# EAGLE design auto_shield_final (EAGLE 9.2.2)
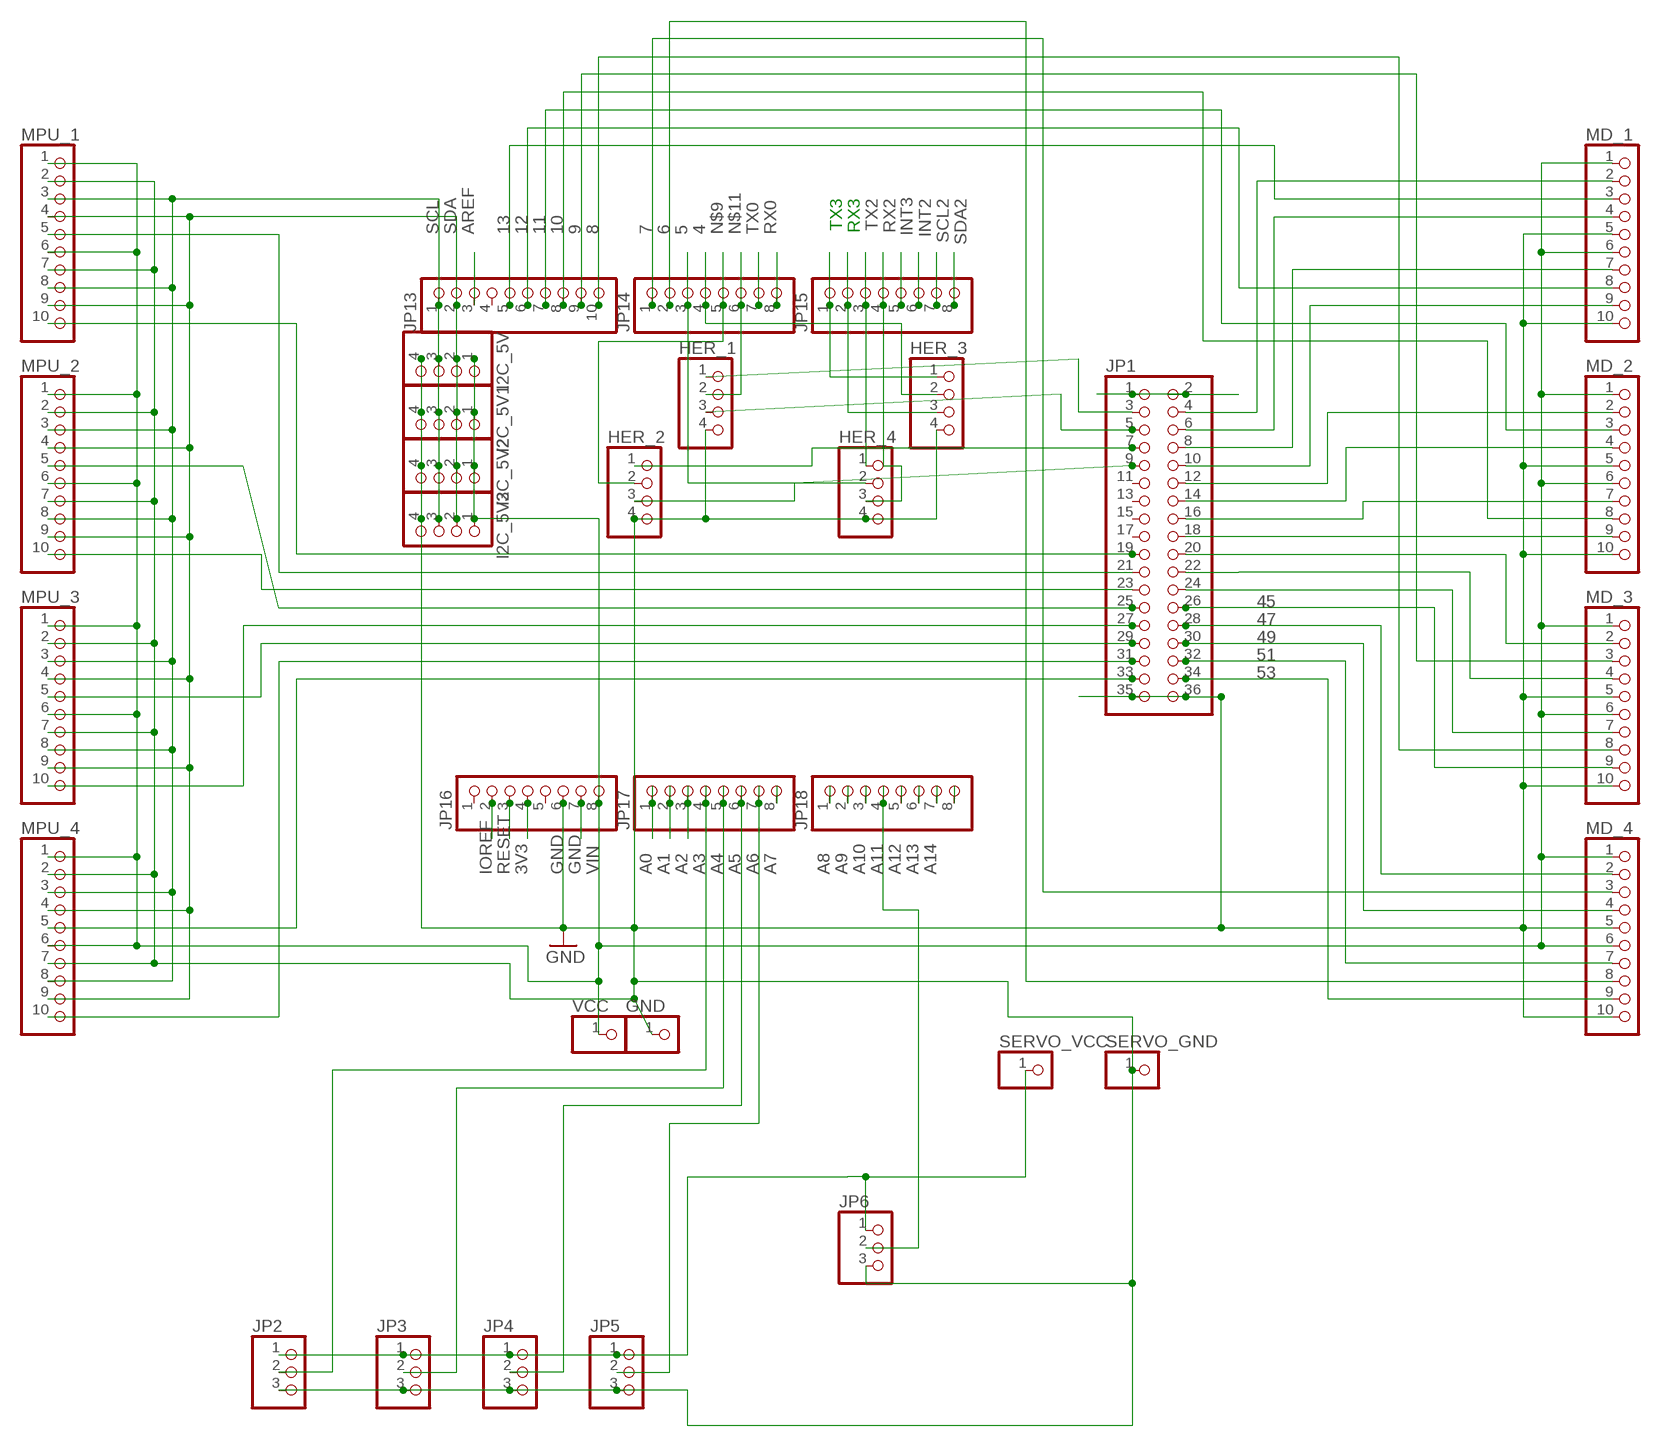
[diagram p0: schematic, sheet 1]

## Parts
GND  PINHD-1X1  [1X01]
HER_1  PINHD-1X4  [1X04]
HER_2  PINHD-1X4  [1X04]
HER_3  PINHD-1X4  [1X04]
HER_4  PINHD-1X4  [1X04]
I2C_5V  PINHD-1X4  [1X04]
I2C_5V1  PINHD-1X4  [1X04]
I2C_5V2  PINHD-1X4  [1X04]
I2C_5V3  PINHD-1X4  [1X04]
JP1  PINHD-2X18  [2X18]
JP2  PINHD-1X3  [1X03]
JP3  PINHD-1X3  [1X03]
JP4  PINHD-1X3  [1X03]
JP5  PINHD-1X3  [1X03]
JP6  PINHD-1X3  [1X03]
JP13  PINHD-1X10  [1X10]
JP14  PINHD-1X8  [1X08]
JP15  PINHD-1X8  [1X08]
JP16  PINHD-1X8  [1X08]
JP17  PINHD-1X8  [1X08]
JP18  PINHD-1X8  [1X08]
MD_1  PINHD-1X10  [1X10]
MD_2  PINHD-1X10  [1X10]
MD_3  PINHD-1X10  [1X10]
MD_4  PINHD-1X10  [1X10]
MPU_1  PINHD-1X10  [1X10]
MPU_2  PINHD-1X10  [1X10]
MPU_3  PINHD-1X10  [1X10]
MPU_4  PINHD-1X10  [1X10]
SERVO_GND  PINHD-1X1  [1X01]
SERVO_VCC  PINHD-1X1  [1X01]
VCC  PINHD-1X1  [1X01]

## Nets
3V3: JP16.4
4: HER_3.2 JP14.4
5: HER_4.2 JP14.3
6: JP14.2 MD_4.8
7: JP14.1 MD_4.3
8: JP13.10 MD_3.8
9: JP13.9 MD_3.3
10: JP13.8 MD_2.8
11: JP13.7 MD_2.3
12: JP13.6 MD_1.8
13: JP13.5 MD_1.3
24: HER_1.3 JP1.5
26: HER_2.1 JP1.7
28: HER_2.3 JP1.9
38: JP1.19 MPU_1.10
44: JP1.25 MPU_2.5
45: JP1.26 MD_3.9
46: JP1.27 MPU_3.10
47: JP1.28 MD_4.2
48: JP1.29 MPU_3.5
49: JP1.30 MD_4.4
50: JP1.31 MPU_4.10
51: JP1.32 MD_4.7
52: JP1.33 MPU_4.5
53: JP1.34 MD_4.9
A0: JP17.1
A1: JP17.2
A2: JP17.3
A3: JP2.2 JP17.4
A4: JP3.2 JP17.5
A5: JP4.2 JP17.6
A6: JP5.2 JP17.7
A7: JP17.8
A8: JP18.1
A9: JP18.2
A10: JP18.3
A11: JP6.2 JP18.4
A12: JP18.5
A13: JP18.6
A14: JP18.7
AREF: JP13.3
GND: GND.1 HER_1.4 HER_2.4 HER_3.4 HER_4.4 I2C_5V1.4 I2C_5V2.4 I2C_5V3.4 I2C_5V.4 JP1.35 JP1.36 JP2.3 JP3.3 JP4.3 JP5.3 JP6.3 JP16.6 JP16.7 MD_1.5 MD_1.10 MD_2.5 MD_2.10 MD_3.5 MD_3.10 MD_4.5 MD_4.10 MPU_1.2 MPU_1.7 MPU_2.2 MPU_2.7 MPU_3.2 MPU_3.7 MPU_4.2 MPU_4.7 SERVO_GND.1
INT2: JP15.6
INT3: JP15.5
IOREF: JP16.2
N$1: HER_1.1 JP1.3
N$2: JP1.1 JP1.2
N$3: JP18.8
N$4: JP1.4 MD_1.2
N$5: JP2.1 JP3.1 JP4.1 JP5.1 JP6.1 SERVO_VCC.1
N$6: JP1.6 MD_1.4
N$7: JP1.8 MD_1.7
N$8: JP1.10 MD_1.9
N$9: HER_2.2 JP14.5
N$11: HER_1.2 JP14.6
N$12: JP1.14 MD_2.4
N$13: JP1.12 MD_2.2
N$14: JP1.16 MD_2.7
N$15: JP1.18 MD_2.9
N$16: JP1.20 MD_3.2
N$17: JP1.22 MD_3.4
N$18: JP1.24 MD_3.7
N$20: JP1.21 MPU_1.5
N$25: JP1.23 MPU_2.10
RESET: JP16.3
RX0: JP14.8
RX2: HER_4.3 JP15.4
RX3: HER_3.3 JP15.2
SCL: I2C_5V1.3 I2C_5V2.3 I2C_5V3.3 I2C_5V.3 JP13.1 MPU_1.3 MPU_1.8 MPU_2.3 MPU_2.8 MPU_3.3 MPU_3.8 MPU_4.3 MPU_4.8
SCL2: JP15.7
SDA: I2C_5V1.2 I2C_5V2.2 I2C_5V3.2 I2C_5V.2 JP13.2 MPU_1.4 MPU_1.9 MPU_2.4 MPU_2.9 MPU_3.4 MPU_3.9 MPU_4.4 MPU_4.9
SDA2: JP15.8
TX0: JP14.7
TX2: HER_4.1 JP15.3
TX3: HER_3.1 JP15.1
VIN: I2C_5V1.1 I2C_5V2.1 I2C_5V3.1 I2C_5V.1 JP16.8 MD_1.1 MD_1.6 MD_2.1 MD_2.6 MD_3.1 MD_3.6 MD_4.1 MD_4.6 MPU_1.1 MPU_1.6 MPU_2.1 MPU_2.6 MPU_3.1 MPU_3.6 MPU_4.1 MPU_4.6 VCC.1
Unconnected: JP1.11 JP1.13 JP1.15 JP1.17 JP13.4 JP16.1 JP16.5

## Library data of the parts
GND SERVO_GND SERVO_VCC VCC = pinhead:PINHD-1X1: PIN HEADER
HER_1-HER_4 I2C_5V I2C_5V1-I2C_5V3 = pinhead:PINHD-1X4: PIN HEADER
JP1 = pinhead:PINHD-2X18: PIN HEADER
JP2-JP6 = pinhead:PINHD-1X3: PIN HEADER
JP13 MD_1-MD_4 MPU_1-MPU_4 = pinhead:PINHD-1X10: PIN HEADER
JP14-JP18 = pinhead:PINHD-1X8: PIN HEADER

## Net classes
1 vcc: width 0.305 mm

## Board
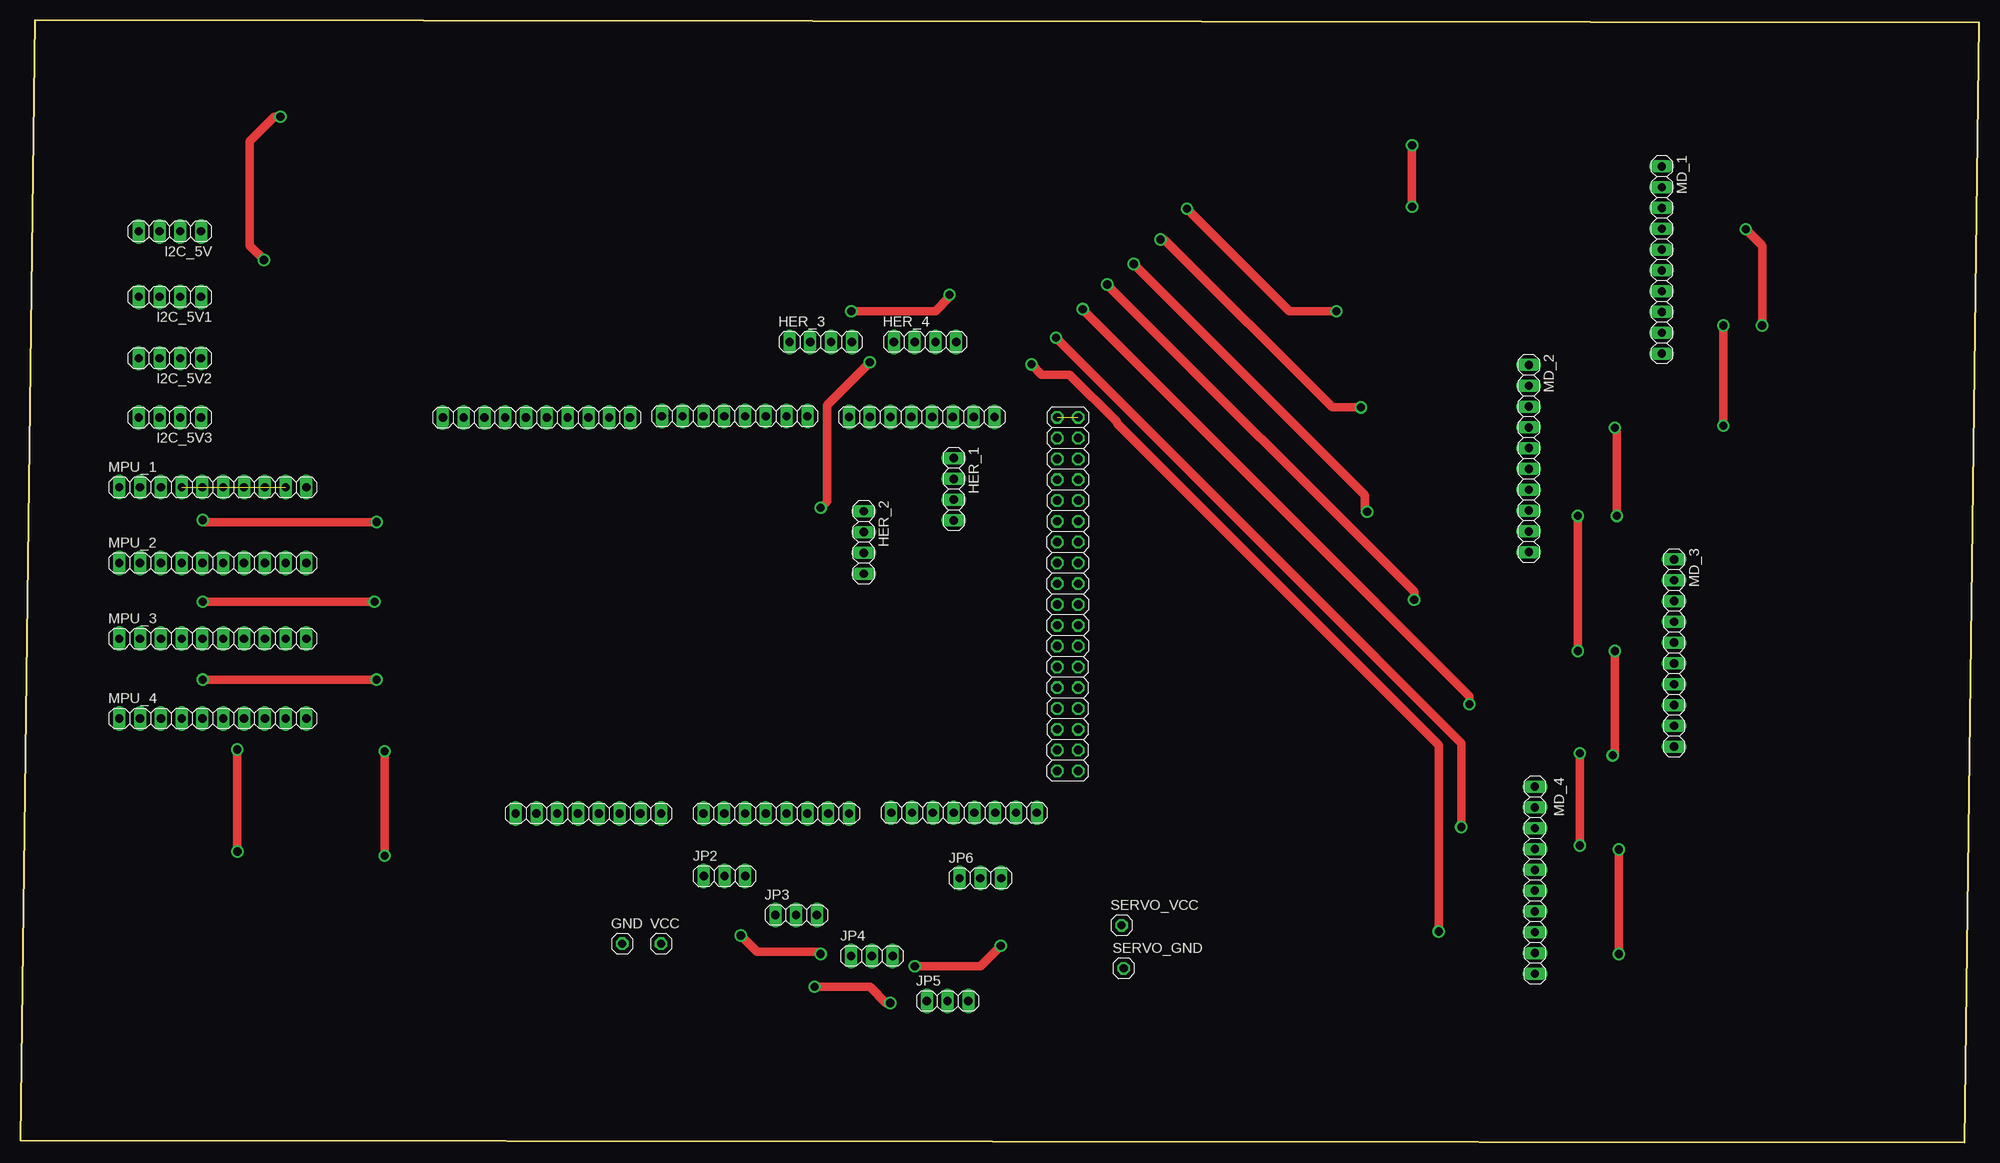
[diagram p1: board, top side]
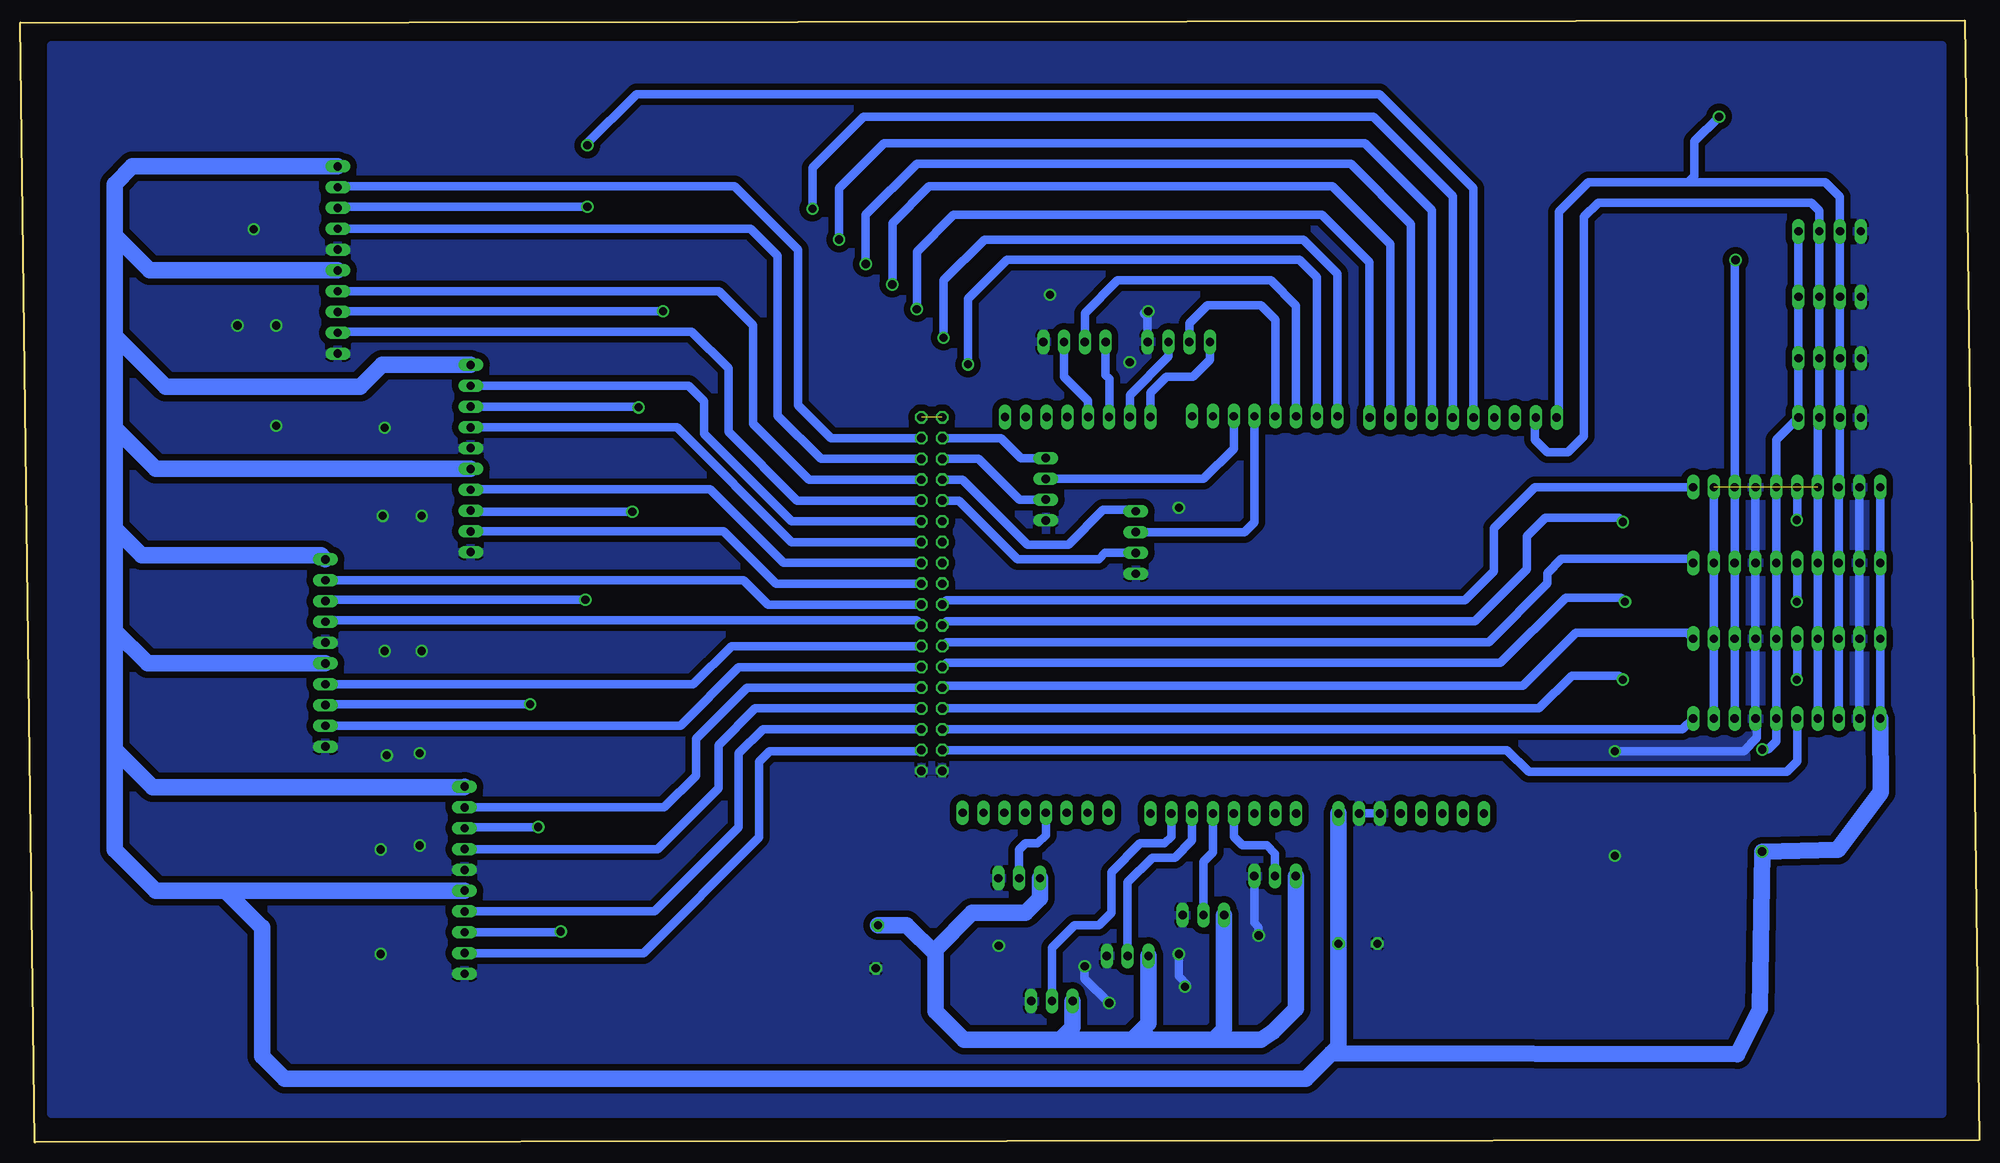
[diagram p2: board, bottom side, seen from below]

Size 239.25 x 137 mm. Coordinates in mm from the lower left corner, seen from the top.
Outline: 0,0.25 237.5,0 239.25,136.75 1.75,137 0,0.25
Copper layers (1*16): Top 0.035mm / dielectric 1.5mm / Bottom 0.035mm
Design rules "default": minimum track width 10mil, minimum drill 24mil, track to track 8mil, track to pad 8mil, pad to pad 8mil, via to via 8mil, smd to smd 8mil, copper to edge 40mil, drill to drill 8mil, minimum pad ring 10mil, minimum via ring 8mil, stop-mask expansion 4mil, vias tented up to drill 0mil, thermal gap 10mil

### Footprints (pad centres in the part's own frame; a part is rotated, then mirrored left to right if it is on the bottom)
1X01 = drill 1.016 octagon: 1 0,0
1X04 = drill 1.016 long: 1 -3.81,0; 2 -1.27,0; 3 1.27,0; 4 3.81,0
2X18 = drill 1.016 octagon: 1 -21.59,-1.27; 2 -21.59,1.27; 3 -19.05,-1.27; 4 -19.05,1.27; 5 -16.51,-1.27; 6 -16.51,1.27; 7 -13.97,-1.27; 8 -13.97,1.27; 9 -11.43,-1.27; 10 -11.43,1.27; 11 -8.89,-1.27; 12 -8.89,1.27; 13 -6.35,-1.27; 14 -6.35,1.27; 15 -3.81,-1.27; 16 -3.81,1.27; 17 -1.27,-1.27; 18 -1.27,1.27; 19 1.27,-1.27; 20 1.27,1.27; 21 3.81,-1.27; 22 3.81,1.27; 23 6.35,-1.27; 24 6.35,1.27; 25 8.89,-1.27; 26 8.89,1.27; 27 11.43,-1.27; 28 11.43,1.27; 29 13.97,-1.27; 30 13.97,1.27; 31 16.51,-1.27; 32 16.51,1.27; 33 19.05,-1.27; 34 19.05,1.27; 35 21.59,-1.27; 36 21.59,1.27
1X03 = drill 1.016 long: 1 -2.54,0; 2 0,0; 3 2.54,0
1X10 = drill 1.016 long: 1 -11.43,0; 2 -8.89,0; 3 -6.35,0; 4 -3.81,0; 5 -1.27,0; 6 1.27,0; 7 3.81,0; 8 6.35,0; 9 8.89,0; 10 11.43,0
1X08 = drill 1.016 long: 1 -8.89,0; 2 -6.35,0; 3 -3.81,0; 4 -1.27,0; 5 1.27,0; 6 3.81,0; 7 6.35,0; 8 8.89,0

### Placement (x,y rotation side)
GND  73.5,24.25 0 top
HER_1  114,79.75 270 top
HER_2  103,73.25 270 top
HER_3  97.75,97.75 0 top
HER_4  110.5,97.75 0 top
I2C_5V  18.25,111.25 180 top
I2C_5V1  18.25,103.25 180 top
I2C_5V2  18.25,95.75 180 top
I2C_5V3  18.25,88.5 180 top
JP1  127.92,66.94 270 top
JP2  86,32.5 0 top
JP3  94.75,27.75 0 top
JP4  104,22.75 0 top
JP5  113.25,17.25 0 top
JP6  117.25,32.25 0 top
JP13  63.02,88.5 0 top
JP14  87.24,88.67 0 top
JP15  110.09,88.58 0 top
JP16  69.37,40.16 0 top
JP17  92.32,40.16 0 top
JP18  115.26,40.24 0 top
MD_1  200.5,107.75 270 top
MD_2  184.25,83.5 270 top
MD_3  202,59.75 270 top
MD_4  185,32 270 top
MPU_1  23.5,80 0 top
MPU_2  23.5,70.75 0 top
MPU_3  23.5,61.5 0 top
MPU_4  23.5,51.75 0 top
SERVO_GND  134.75,21.25 0 top
SERVO_VCC  134.5,26.5 0 top
VCC  78.25,24.25 0 top

### Tracks (layer width: path | path; a pad name or v marks a point on that pad's centre or on a via)
4
  Bottom 1.016: HER_3.2 96.48,100.02 94.25,102.25 87.75,102.25 85.97,100.47 JP14.4
5
  Bottom 1.016: 83.36,88.6 JP14.3 83.43,102.18 86.5,105.25 105.25,105.25 109.23,101.27 HER_4.2
6  (via drill 1 pad 1.3)
  Top 1.016: v173.25,25.75 173.25,48.5 133.92,87.83 133.92,87.97 128.14,93.75 124.75,93.75 v123.5,95
  Bottom 1.016: MD_4.8 173.35,25.65 v173.25,25.75 | v123.5,95 123.5,103 118.75,107.75 83,107.75 80.89,105.64 JP14.2
7  (via drill 1 pad 1.3)
  Top 1.016: v126.5,98.25 176,48.75 v176,38.5
  Bottom 1.016: JP14.1 78.35,106.1 82.5,110.25 121.5,110.25 126.5,105.25 v126.5,98.25 | v176,38.5 184.85,38.5 MD_4.3
8  (via drill 1 pad 1.3)
  Top 1.016: v177,53.5 177,54.5 v129.75,101.75
  Bottom 1.016: JP13.10 74.45,107.45 80.25,113.25 125.25,113.25 129.75,108.75 v129.75,101.75 | v177,53.5 201.9,53.5 MD_3.8
9  (via drill 1 pad 1.3)
  Top 1.016: v170.25,66.25 170.25,67.25 v132.75,104.75
  Bottom 1.016: JP13.9 71.92,109.67 79,116.75 128.25,116.75 132.75,112.25 v132.75,104.75 | v170.25,66.25 201.85,66.25 MD_3.3
10  (via drill 1 pad 1.3)
  Top 1.016: v136,107.25 164.25,79 164.25,77 v164.5,77
  Bottom 1.016: JP13.8 69.38,112.12 76.75,119.5 129.75,119.5 136,113.25 v136,107.25 | v164.5,77 184.1,77 MD_2.8
11  (via drill 1 pad 1.3)
  Top 1.016: v139.25,110.25 139.75,110.25 160.25,89.75 v163.75,89.75
  Bottom 1.016: JP13.7 66.83,113.83 75,122 133.75,122 139.25,116.5 v139.25,110.25 | v163.75,89.75 163.85,89.85 MD_2.3
12  (via drill 1 pad 1.3)
  Top 1.016: v142.5,114 155,101.5 v160.75,101.5
  Bottom 1.016: JP13.6 64.3,115.55 74,125.25 136.25,125.25 142.5,119 v142.5,114 | v160.75,101.5 200.4,101.5 MD_1.8
13  (via drill 1 pad 1.3)
  Top 1.016: v170,121.75 v170,114.25
  Bottom 1.016: JP13.5 61.76,116.5 73.25,128 164,128 170.25,121.75 v170,121.75 | v170,114.25 200.35,114.25 MD_1.3
24
  Bottom 1.016: HER_1.3 117.23,78.48 122.25,83.5 126.61,83.5 JP1.5
26
  Bottom 1.016: JP1.7 124.17,80.92 116.25,73 111.25,73 107,77.25 103.19,77.25 HER_2.1
28
  Bottom 1.016: HER_2.3 106.75,71.98 107.5,71.23 117.48,71.23 124.62,78.38 JP1.9
38
  Bottom 1.016: JP1.19 126.15,66.17 62.83,66.17 59.25,69.75 59.25,75 54.25,80 MPU_1.10
44  (via drill 1 pad 1.3)
  Top 1.016: v22.25,66 v43.25,66
  Bottom 1.016: MPU_2.5 22.23,66.02 v22.25,66 | v43.25,66 43.75,66.5 50.5,66.5 58.45,58.55 126.15,58.55 JP1.25
45
  Bottom 1.016: MD_3.9 158.64,50.86 151.5,58 129.25,58 JP1.26
46
  Bottom 1.016: JP1.27 126.4,55.77 55.73,55.77 49.25,62.25 35.68,62.25 MPU_3.10
47
  Bottom 1.016: JP1.28 150.49,55.52 156.75,49.25 156.75,44.75 160.61,40.89 MD_4.2
48  (via drill 1 pad 1.3)
  Top 1.016: v22.25,56.5 v43.5,56.5
  Bottom 1.016: MPU_3.5 22.23,56.77 22.25,56.75 v22.25,56.5 | v43.5,56.5 44,57 49.75,57 53.75,53 126.63,53 JP1.29
49
  Bottom 1.016: MD_4.4 161.44,35.81 154,43.25 154,48.5 149.5,53 149.47,52.98 JP1.30
50
  Bottom 1.016: JP1.31 36.24,50.44 MPU_4.10
51
  Bottom 1.016: JP1.32 148.56,50.44 151.5,47.5 151.5,38.5 161.81,28.19 MD_4.7
52
  Bottom 1.016: MPU_4.5 22.23,46.52 23.5,45.25 55.01,45.25 57.65,47.9 JP1.33
53
  Bottom 1.016: MD_4.9 163.14,23.11 149,37.25 149,46.5 147.75,47.75 129.34,47.75 JP1.34
A3
  Bottom 1.016: JP2.2 86,35.25 87,36.25 90,36.25 91.05,37.3 JP17.4
A4
  Bottom 1.016: JP3.2 94.75,34.25 93.59,35.41 JP17.5
A5
  Bottom 1.016: JP17.6 96.13,36.87 98.25,34.75 101,34.75 104,31.75 JP4.2
A6
  Bottom 1.016: JP17.7 98.67,37.33 99.5,36.5 102.5,36.5 106,33 106,28 107.5,26.5 110.5,26.5 113.25,23.75 JP5.2
A11
  Bottom 1.016: JP6.2 117.25,35.75 116.5,36.5 115,36.5 113.99,37.51 JP18.4
GND  (via drill 1 pad 1.3)
  Top 1.016: v210.75,111.5 212.75,109.5 v212.75,99.75 | v208,99.75 v208,87.5 | v195,76.5 195,86.75 194.75,87 v194.75,87.25 | v190.25,76.5 v190.25,60 | v194.75,60 194.75,47.5 v194.5,47.25 | v190.5,47.5 v190.5,36.25 | v195.25,35.75 v195.25,23 | v101.5,101.5 111.75,101.5 113.5,103.25 v113.5,103.5 | v97.75,77.5 98.5,78.25 98.5,90 v103.75,95.25 | v44.5,47.75 v44.5,35 | v88,25.25 90,23.25 97.75,23.25 v97.75,23 | v97,19 103.75,19 105.75,17 v106.25,17 | v109.25,21.5 117.25,21.5 v119.75,24
  Bottom 1.016: JP16.6 JP16.7 | MPU_4.2 MPU_3.2 MPU_2.2 MPU_1.2 | MPU_1.7 MPU_2.7 MPU_3.7 MPU_4.7 27.13,51.57 27.13,49.38 28.75,47.75 v44.5,47.75 | 210.75,111.75 v210.75,111.5 | 208.07,99.82 v208,99.75 | HER_3.4 101.56,100.81 102,101.25 101.75,101.5 v101.5,101.5 | HER_1.4 114,76.25 | JP2.3 88.54,26.79 88,26.25 v88,25.25 | v97.75,23 97.75,20.25 96.75,19.25 v97,19 | v106.25,17 109.25,20 v109.25,21.5
  pour Bottom (isolate 0.8): 4.5,134 4.5,3.5 235.5,3.5 235.5,134
N$1
  Bottom 1.016: HER_1.1 117.06,83.56 119.5,86 JP1.3
N$2  (1 unrouted)
N$4
  Bottom 1.016: JP1.4 140.25,86 144.25,90 144.25,109 152,116.75 200.39,116.75 MD_1.2
N$5
  Bottom 2: JP2.1 83.46,16.29 86.25,13.5 87.75,12.5 92.25,12.5 | 92.25,12.5 93.5,12.5 | 93.5,12.5 101.75,12.5 | 101.75,12.5 103.5,12.5 | 103.5,12.5 110.25,12.5 | 110.25,12.5 112.25,12.5 | 112.25,12.5 124,12.5 127.5,16 127.5,23 | 127.5,23 131,26.5 SERVO_VCC.1 | 92.21,12.54 92.25,12.5 | 101.46,12.79 101.75,12.5 | 110.71,12.96 110.25,12.5 | JP3.1 92.21,13.79 93.5,12.5 | JP4.1 101.46,14.54 103.5,12.5 | JP5.1 110.71,14.04 112.25,12.5 | JP6.1 114.71,29.79 116.5,28 123,28 127.5,23.5 127.5,23
N$6
  Bottom 1.016: MD_1.4 150.06,111.56 146.75,108.25 146.75,88.75 141.46,83.45 JP1.6
N$7
  Bottom 1.016: JP1.8 142.91,80.92 149.75,87.75 149.75,99.75 153.94,103.94 MD_1.7
N$8
  Bottom 1.016: JP1.10 144.38,78.38 152.75,86.75 152.75,94.5 157.25,99 200.39,99 200.5,98.89 MD_1.9
N$9
  Bottom 1.016: JP14.5 88.51,75.74 89.73,74.52 HER_2.2
N$11
  Bottom 1.016: JP14.6 91.05,84.7 94.73,81.02 HER_1.2
N$12
  Bottom 1.016: MD_2.4 159.06,87.31 145.04,73.3 JP1.14
N$13
  Bottom 1.016: JP1.12 145.09,75.83 155.75,86.5 155.75,90.5 157.64,92.39 MD_2.2
N$14
  Bottom 1.016: JP1.16 146,70.75 155,79.75 184.19,79.75 MD_2.7
N$15
  Bottom 1.016: MD_2.9 153.36,74.61 146.97,68.22 JP1.18
N$16
  Bottom 1.016: JP1.20 147.93,65.67 150.89,68.64 MD_3.2
N$17
  Bottom 1.016: MD_3.4 201.81,63.75 129.81,63.75 JP1.22
N$18
  Bottom 1.016: JP1.24 152.41,60.59 157.06,55.94 MD_3.7
N$20  (via drill 1 pad 1.3)
  Top 1.016: v22.25,76 22.5,75.75 v43.5,75.75
  Bottom 1.016: MPU_1.5 22.23,76.27 22.25,76.25 v22.25,76 | v43.5,75.75 44,76.25 53,76.25 55.25,74 55.25,70 61.62,63.63 126.15,63.63 JP1.21
N$25
  Bottom 1.016: MPU_2.10 35.43,71.25 51,71.25 52.75,69.5 52.75,68.25 59.91,61.09 126.15,61.09 JP1.23
RX2
  Bottom 1.016: JP15.4 108.83,90.58 111.75,93.5 111.75,97.73 HER_4.3
RX3
  Bottom 1.016: HER_3.3 99.02,95.98 103.75,91.25 JP15.2
SCL  (via drill 1 pad 1.3)
  Top 1.016: v29.75,107.75 28,109.5 28,122.25 31,125.25 v31.75,125.25
  Bottom 1.016: MPU_4.3 MPU_3.3 MPU_2.3 MPU_1.3 16.98,80.17 I2C_5V3.3 I2C_5V2.3 I2C_5V1.3 I2C_5V.3 17.09,111.36 17,111.46 17,115.5 18.75,117.25 35.5,117.25 | MPU_4.8 MPU_3.8 MPU_2.8 MPU_1.8 29.85,107.15 29.75,107.25 v29.75,107.75 | JP13.1 51.34,88.75 51.34,113.66 47.75,117.25 35.5,117.25 | v31.75,125.25 34.75,122.25 34.75,118 35.5,117.25
SDA  (1 unrouted)
  Bottom 1.016: MPU_1.9 MPU_2.9 MPU_3.9 MPU_4.9 | MPU_4.4 MPU_3.4 MPU_2.4 MPU_1.4 19.69,88.33 I2C_5V3.2 I2C_5V2.2 I2C_5V1.2 I2C_5V.2 19.52,113.77 20.5,114.75 46.5,114.75 48.25,113 48.25,86.25 50.25,84.25 52.75,84.25 54.27,85.77 54.27,88.36 JP13.2
TX2
  Bottom 1.016: HER_4.1 106.69,93.69 106.25,93.25 106.25,88.62 JP15.3
TX3
  Bottom 1.016: HER_3.1 93.94,95.56 96,93.5 99.25,93.5 101.2,91.55 JP15.1
VIN  (via drill 1 pad 1.3)
  Top 1.016: v26.47,47.97 v26.5,35.5
  Bottom 1.016: MPU_1.1 MPU_2.1 MPU_3.1 MPU_4.1 | MPU_1.6 MPU_2.6 MPU_3.6 MPU_4.6 24.77,48.98 25.75,48 26.5,48 v26.47,47.97 | 25.02,80.25 MPU_1.6 | I2C_5V.1 I2C_5V1.1 I2C_5V2.1 I2C_5V3.1 24.77,85.79 MPU_1.6
  Bottom 2: JP16.8 78.26,24.26 VCC.1 78.25,11.75 79.12,10.88 | MD_1.1 225.57,119.18 227.75,117 227.75,110.75 | 227.75,110.75 227.75,98.5 | 227.75,98.5 227.75,87.25 | 227.75,87.25 227.75,75 | 227.75,75 227.75,62.5 | 227.75,62.5 227.75,48 | 227.75,48 227.75,35.75 222.73,30.73 214.25,30.73 | 214.25,30.73 MD_4.6 | 227.75,48 223.1,43.35 185.07,43.35 MD_4.1 | MD_3.6 223.73,58.48 227.75,62.5 | MD_3.1 202.5,71.68 224.43,71.68 227.75,75 | MD_2.6 222.73,82.23 227.75,87.25 | MD_2.1 195.07,94.93 197.75,92.25 221.5,92.25 227.75,98.5 | MD_1.6 223.48,106.48 227.75,110.75 | 214.25,30.73 209.77,26.25 209.75,26.25 209.75,10.5 207,7.75 82.25,7.75 79.12,10.88 | MPU_4.1 12,42.75 17.25,35.75 v26.5,35.5 26.75,16.25 29.5,10.75 79.12,10.88